# EAGLE design insider (EAGLE 7.7.0)
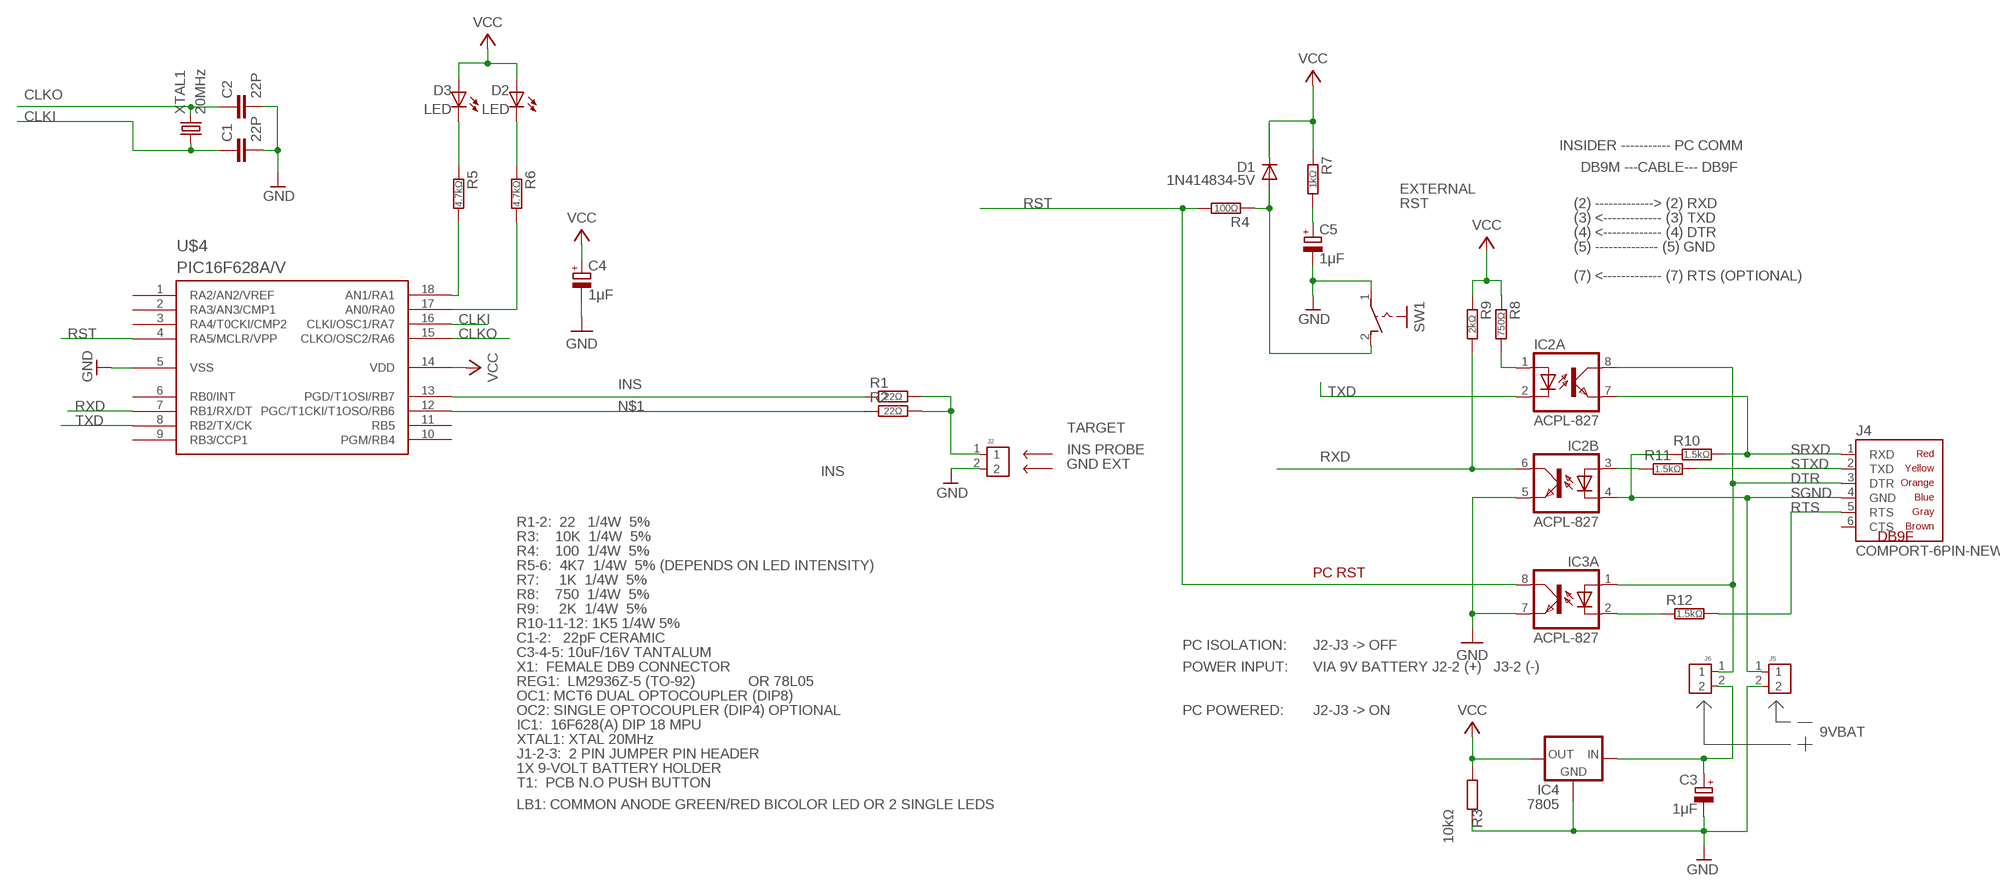
[diagram p0: schematic, sheet 1]

## Parts
C1  22P  C025-020X036  [C025-020X036]
C2  22P  C025-020X036  [C025-020X036]
C3  1μF  CPOLE2,5-4/V  [E2.5-4/V]
C4  1μF  CPOLE2,5-4/V  [E2.5-4/V]
C5  1μF  CPOLE2,5-4/V  [E2.5-4/V]
D1  1N414834-5V  [DO34-5V]
D2  LED  [LED3MM]
D3  LED  [LED3MM]
IC2  ACPL-827  [DIL08]
IC3  ACPL-827  [DIL08]
IC4  7805  LM78  [TO220]
J2  CONN-2P2P/V  [CONN-2P-V]
J4  COMPORT-6PIN-NEW  [RS232-6PIN-NEW]
J5  CONN-2P2P/V  [CONN-2P-V]
J6  CONN-2P2P/V  [CONN-2P-V]
R1  22Ω  R0204/10  [0204/10]
R2  22Ω  R0204/10  [0204/10]
R3  10kΩ  R0204/10  [0204/10]
R4  100Ω  R0204/15  [0204/15]
R5  4.7kΩ  R0204/10  [0204/10]
R6  4.7kΩ  R0204/10  [0204/10]
R7  1kΩ  R0204/10  [0204/10]
R8  750Ω  R0204/12  [0204/12]
R9  2kΩ  R0204/12  [0204/12]
R10  1.5kΩ  R0204/10  [0204/10]
R11  1.5kΩ  R0204/10  [0204/10]
R12  1.5kΩ  R0204/10  [0204/10]
SW1  PB-1P-1T  [PB-1P1T]
U$4  PIC16F628A/V  [DIL18-3/V]
XTAL1  20MHz  CRYSTALHC49  [HC49]

## Nets
CLKI: C1.1 U$4.16(CLKI/OSC1/RA7) XTAL1.1
CLKO: C2.1 U$4.15(CLKO/OSC2/RA6) XTAL1.2
DTR: IC2.8(A:COL) IC3.1(A:A) J4.3(DTR) J6.1
GND: C1.2 C2.2 C3.- C4.- C5.- IC2.5(B:EMIT) IC3.7(A:EMIT) IC4.2(GND) J2.2 J5.2 R3.2 SW1.1(P) U$4.5(VSS)
INS: R1.1 U$4.13(PGD/T1OSI/RB7)
N$1: R2.1 U$4.12(PGC/T1CKI/T1OSO/RB6)
N$3: R5.2 U$4.18(AN1/RA1)
N$5: IC2.3(B:A) R11.1
N$6: IC2.1(A:A) R8.2
N$8: IC3.2(A:C) R12.1
N$9: J2.1 R1.2 R2.2
N$12: R6.2 U$4.17(AN0/RA0)
N$13: C5.+ R7.2
N$14: D2.K(C) R6.1
N$15: D3.K(C) R5.1
N$19: D1.A R4.1 SW1.2(S)
N$20: C3.+ IC4.1(IN) J6.2
RST: IC3.8(A:COL) R4.2 U$4.4(RA5/MCLR/VPP)
RTS: J4.5(RTS) R12.2
RXD: IC2.6(B:COL) R9.2 U$4.7(RB1/RX/DT)
SGND: IC2.4(B:C) J4.4(GND) J5.1 R10.1
SRXD: IC2.7(A:EMIT) J4.1(RXD) R10.2
STXD: J4.2(TXD) R11.2
TXD: IC2.2(A:C) U$4.8(RB2/TX/CK)
VCC: C4.+ D1.C D2.A D3.A IC4.3(OUT) R3.1 R7.1 R8.1 R9.1 U$4.14(VDD)
Unconnected: IC3.3(B:A) IC3.4(B:C) IC3.5(B:EMIT) IC3.6(B:COL) J4.6(CTS) U$4.1(RA2/AN2/VREF) U$4.2(RA3/AN3/CMP1) U$4.3(RA4/T0CKI/CMP2) U$4.6(RB0/INT) U$4.9(RB3/CCP1) U$4.10(PGM/RB4) U$4.11(RB5)

## Notes on the sheet
- INSIDER ----------- PC COMM
- DB9M ---CABLE--- DB9F
- EXTERNAL
- RST | (2) -------------> (2) RXD
- (3) <------------- (3) TXD
- (4) <------------- (4) DTR
- (5) -------------- (5) GND
- (7) <------------- (7) RTS (OPTIONAL)
- TARGET
- INS PROBE
- GND EXT
- R1-2:  22   1/4W  5%
- R3:    10K  1/4W  5% | DB9F
- R4:    100  1/4W  5%
- R5-6:  4K7  1/4W  5% (DEPENDS ON LED INTENSITY)
- PC RST
- R7:     1K  1/4W  5%
- R8:    750  1/4W  5%
- R9:     2K  1/4W  5%
- R10-11-12: 1K5 1/4W 5%
- C1-2:   22pF CERAMIC
- PC ISOLATION: | J2-J3 -> OFF
- C3-4-5: 10uF/16V TANTALUM
- X1:  FEMALE DB9 CONNECTOR | POWER INPUT: | VIA 9V BATTERY J2-2 (+)   J3-2 (-)
- REG1:  LM2936Z-5 (TO-92) | OR 78L05
- OC1: MCT6 DUAL OPTOCOUPLER (DIP8)
- OC2: SINGLE OPTOCOUPLER (DIP4) OPTIONAL | PC POWERED: | J2-J3 -> ON
- IC1:  16F628(A) DIP 18 MPU
- 9VBAT
- XTAL1: XTAL 20MHz
- J1-2-3:  2 PIN JUMPER PIN HEADER
- 1X 9-VOLT BATTERY HOLDER
- T1:  PCB N.O PUSH BUTTON
- LB1: COMMON ANODE GREEN/RED BICOLOR LED OR 2 SINGLE LEDS

## Library data of the parts
C1 C2 = c:C: CAPACITOR, European symbol
C3-C5 = c:CPOL: POLARIZED CAPACITOR, European symbol
D1 = d:1N4148
D2 D3 = d:LED
IC2 IC3 = o:ACPL-827: Opto Couplers Siemens, Hewlett-Packard, Texas Instuments, Sharp, Motorola Created by librarian@cadsoft.de
IC4 = ic:LM78*
J2 J5 J6 = pinconn:CONN-2P
J4 = pinconn:COMPORT-6PIN-NEW
R1-R12 = r:R: RESISTOR, European symbol
SW1 = sw:PB-1P-1T
U$4 = mcu:PIC16F628A
XTAL1 = q:CRYSTAL

## Board
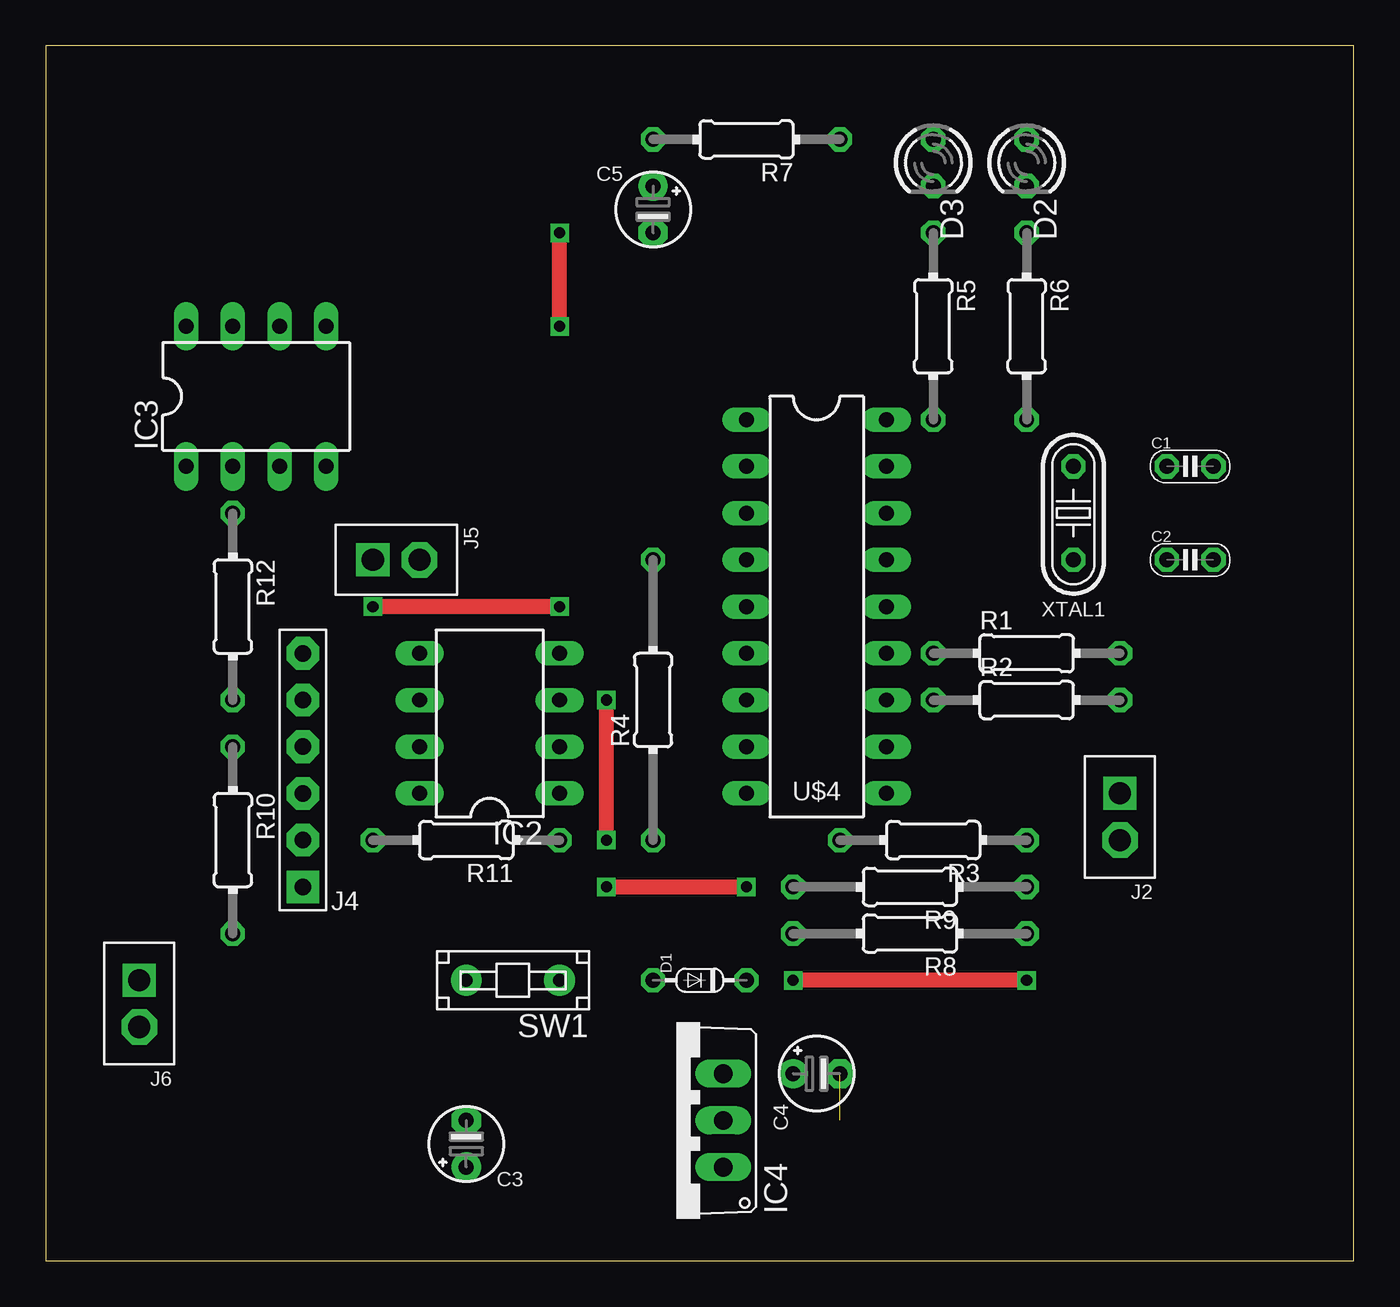
[diagram p1: board, top side]
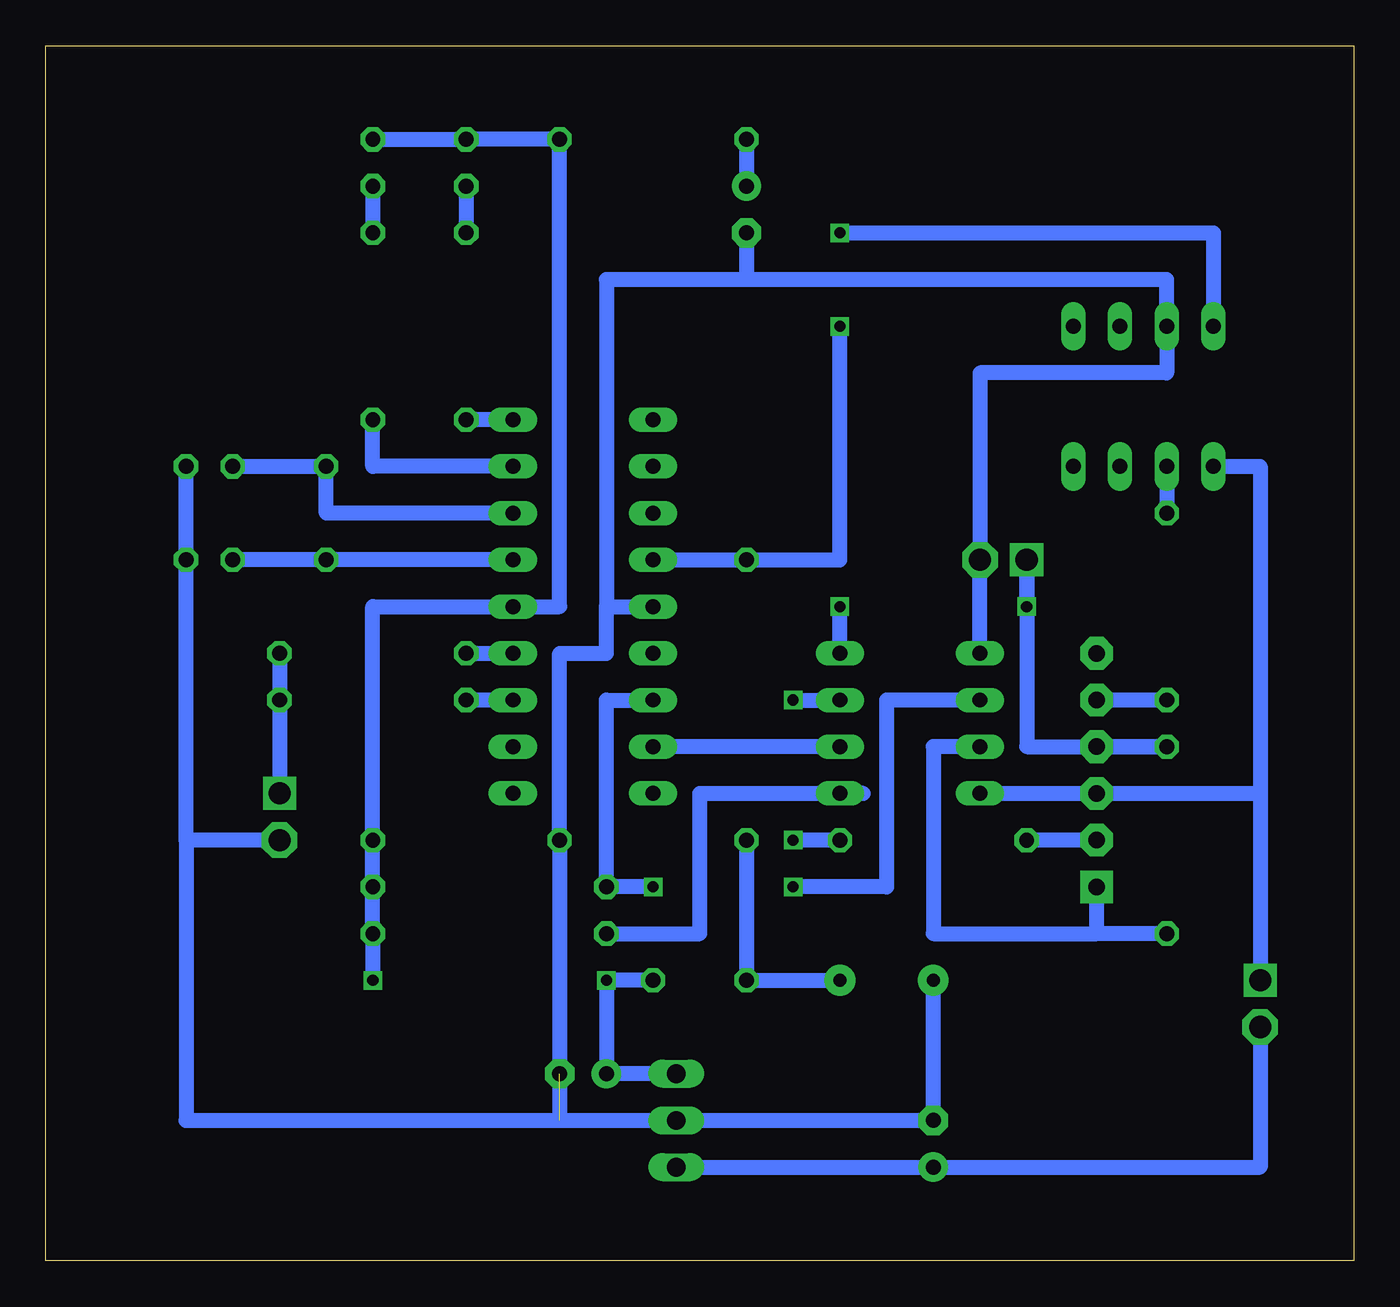
[diagram p2: board, bottom side, seen from below]

Size 71.12 x 66.04 mm. Coordinates in mm from the lower left corner, seen from the top.
Outline: 0,0 71.12,0 71.12,66.04 0,66.04 0,0
Copper layers (1*16): Top 0.035mm / dielectric 1.5mm / Bottom 0.035mm
Design rules "default": minimum track width 10mil, minimum drill 24mil, track to track 8mil, track to pad 8mil, pad to pad 8mil, via to via 8mil, smd to smd 8mil, copper to edge 40mil, drill to drill 8mil, minimum pad ring 10mil, minimum via ring 8mil, stop-mask expansion 4mil, vias tented up to drill 0mil, thermal gap 10mil

### Footprints (pad centres in the part's own frame; a part is rotated, then mirrored left to right if it is on the bottom)
C025-020X036 = drill 0.813 octagon: 1 0,0; 2 2.54,0
E2.5-4/V = drill 0.813 pad 1.6: + 0,2.54 | drill 0.813 pad 1.6 octagon: - 0,0
DO34-5V = drill 0.813 octagon: A 0,2.54; C 0,-2.54
LED3MM = drill 0.813 octagon: A -1.27,0; K 1.27,0
DIL08 = drill 0.813 long: 1 -3.81,3.81; 2 -3.81,1.27; 3 -3.81,-1.27; 4 -3.81,-3.81; 5 3.81,-3.81; 6 3.81,-1.27; 7 3.81,1.27; 8 3.81,3.81
TO220 = drill 1.016 long: 1 -2.54,-2.54; 2 0,-2.54; 3 2.54,-2.54
CONN-2P-V = drill 1.2 pad 1.778 square: 1 0,0 | drill 1.2 pad 1.93 octagon: 2 0,2.54
RS232-6PIN-NEW = drill 0.9 pad 1.778 square: 1 0,-6.35 | drill 0.9 pad 1.778 octagon: 2 0,-3.81; 3 0,-1.27; 4 0,1.27; 5 0,3.81; 6 0,6.35
0204/10 = drill 0.813 octagon: 1 -5.08,0; 2 5.08,0
0204/15 = drill 0.813 octagon: 1 -7.62,0; 2 7.62,0
0204/12 = drill 0.813 octagon: 1 -6.35,0; 2 6.35,0
PB-1P1T = drill 0.7 pad 1.676: 1 2.54,0; 2 -2.54,0
DIL18-3/V = drill 0.813 long: 1 -3.81,10.16; 2 -3.81,7.62; 3 -3.81,5.08; 4 -3.81,2.54; 5 -3.81,0; 6 -3.81,-2.54; 7 -3.81,-5.08; 8 -3.81,-7.62; 9 -3.81,-10.16; 10 3.81,-10.16; 11 3.81,-7.62; 12 3.81,-5.08; 13 3.81,-2.54; 14 3.81,0; 15 3.81,2.54; 16 3.81,5.08; 17 3.81,7.62; 18 3.81,10.16
HC49 = drill 0.813 octagon: 1 0,-2.54; 2 0,2.54

### Placement (x,y rotation side)
C1  60.96,43.18 0 top
C2  60.96,38.1 0 top
C3  22.86,7.62 180 top
C4  43.18,10.16 90 top
C5  33.02,55.88 0 top
D1  35.56,15.24 90 top
D2  53.34,59.69 270 top
D3  48.26,59.69 270 top
IC2  24.13,29.21 180 top
IC3  11.43,46.99 90 top
IC4  34.29,7.62 90 top
J2  58.42,25.4 180 top
J4  13.97,26.67 0 top
J5  17.78,38.1 270 top
J6  5.08,15.24 180 top
R1  53.34,33.02 0 top
R2  53.34,30.48 0 top
R3  48.26,22.86 180 top
R4  33.02,30.48 90 top
R5  48.26,50.8 270 top
R6  53.34,50.8 270 top
R7  38.1,60.96 180 top
R8  46.99,17.78 180 top
R9  46.99,20.32 180 top
R10  10.16,22.86 270 top
R11  22.86,22.86 180 top
R12  10.16,35.56 270 top
SW1  25.4,15.24 180 top
U$4  41.91,35.56 0 top
XTAL1  55.88,40.64 180 top

### Tracks (layer width: path | path; a pad name or v marks a point on that pad's centre or on a via)
CLKI
  Bottom 0.813: U$4.16 55.88,40.64 XTAL1.1 C1.1
CLKO
  Bottom 0.813: U$4.15 XTAL1.2 C2.1
DTR
  Bottom 0.813: IC2.8 J4.3 5.08,25.4 | 5.08,25.4 J6.1 | IC3.1 5.08,43.18 5.08,25.4
GND  (1 unrouted)
  Bottom 0.813: 43.18,7.62 R3.2 43.18,33.02 40.64,33.02 40.64,35.56 | 43.18,7.62 IC4.2 C3.- SW1.1 | 63.5,22.86 C2.2 C1.2 | 40.64,35.56 40.64,53.34 33.02,53.34 | 33.02,53.34 10.16,53.34 IC3.7 10.16,48.26 20.32,48.26 J5.2 IC2.5 | C5.- 33.02,53.34 | J2.2 63.5,22.86 | 63.5,22.86 63.5,7.62 43.18,7.62 | 40.64,35.56 U$4.5
INS
  Bottom 0.813: R1.1 U$4.13
N$1
  Bottom 0.813: U$4.12 R2.1
N$3
  Bottom 0.813: U$4.18 R5.2
N$5  (via drill 0.6)
  Top 0.813: v30.48,22.86 v30.48,30.48
  Bottom 0.813: R11.1 v30.48,22.86 | v30.48,30.48 IC2.3
N$6
  Bottom 0.813: R8.2 35.56,17.78 35.56,25.4 IC2.1 26.67,25.4
N$8
  Bottom 0.813: IC3.2 R12.1
N$9
  Bottom 0.813: J2.1 R2.2 R1.2
N$12
  Bottom 0.813: U$4.17 53.34,43.18 R6.2
N$13
  Bottom 0.813: R7.2 C5.+
N$14
  Bottom 0.813: D2.K R6.1
N$15
  Bottom 0.813: D3.K R5.1
N$19
  Bottom 0.813: R4.1 D1.A SW1.2
N$20
  Bottom 0.813: J6.2 5.08,5.08 C3.+ IC4.1
RST  (via drill 0.6)
  Top 0.813: v27.94,50.8 v27.94,55.88
  Bottom 0.813: U$4.4 R4.2 27.94,38.1 v27.94,50.8 | v27.94,55.88 7.62,55.88 IC3.8
RTS
  Bottom 0.813: R12.2 J4.5
RXD  (via drill 0.6)
  Top 0.813: v30.48,20.32 v38.1,20.32
  Bottom 0.813: U$4.7 40.64,30.48 R9.2 v38.1,20.32 | IC2.6 25.4,30.48 25.4,20.32 v30.48,20.32
SGND  (via drill 0.6)
  Top 0.813: v27.94,35.56 v17.78,35.56
  Bottom 0.813: J4.4 R10.1 17.78,27.94 J5.1 v17.78,35.56 | IC2.4 v27.94,35.56
SRXD
  Bottom 0.813: IC2.7 22.86,27.94 22.86,17.78 13.97,17.78 | 13.97,17.78 J4.1 13.97,19.05 | R10.2 13.97,17.78
STXD
  Bottom 0.813: J4.2 R11.2
TXD
  Bottom 0.813: IC2.2 U$4.8
VCC  (via drill 0.6)
  Top 0.813: v53.34,15.24 v40.64,15.24
  Bottom 0.813: D1.C v40.64,15.24 C4.+ IC4.3 | v53.34,15.24 R8.1 R9.1 R3.1 53.34,35.56 U$4.14 43.18,35.56 R7.1 D3.A D2.A